# Altium schematic sheet CC-S12-V00-PowerSwitch.SchDoc: Power Switch (5V or USB to VBUS)
size A3; DrawnBy: Jonn Dillon; DocumentNumber: 13; SheetNumber: 13; SheetTotal: 13; Project: Chassis Controller (Interim) 2020
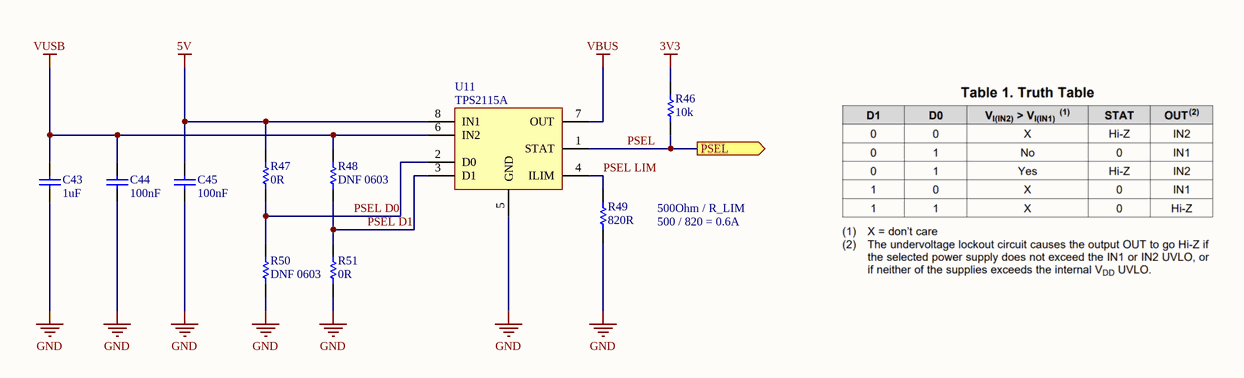
[diagram p0: CC-S12-V00-PowerSwitch.SchDoc]

## Parts
C43  1uF  [Cap_Ceramic_0603]
C44  100nF  [Cap_Ceramic_0603]
C45  100nF  [Cap_Ceramic_0603]
R46  10k  [Res_ThinFilm_0603]
R47  0R  [Res_ThinFilm_0603]
R48  DNF 0603  [Res_ThinFilm_0603]
R49  820R  [Res_ThinFilm_0603]
R50  DNF 0603  [Res_ThinFilm_0603]
R51  0R  [Res_ThinFilm_0603]
U11  TPS2115A  [TPS2115A]

## Ports
PSEL (out)

## Nets
3V3: R46.2
5V: C45.2 R47.2 U11.8(IN1)
GND: C43.1 C44.1 C45.1 R49.1 R50.1 R51.1 U11.5(GND)
VBUS: U11.7(OUT)
VUSB: C43.2 C44.2 R48.2 U11.6(IN2)
PSEL: R46.1 U11.1(STAT) ; port PSEL
PSEL D0: R47.1 R50.2 U11.2(D0)
PSEL D1: R48.1 R51.2 U11.3(D1)
PSEL LIM: R49.2 U11.4(ILIM)

## Notes on the sheet
- 500Ohm / R_LIM
- 500 / 820 = 0.6A
- Revision History:
- Sheet Title:
- Rev
- Date
- Description
- Project:
- Size:
- Drawn By:
- A3
- Number:
- Revision:
- Sheet
- Version:
- of
- QUT Motorsport
- O-120, Gardens Point
- 2 George Street
- Brisbane, QLD 4000
- Australia
- Print Date:
- Print Time:
- File Name:

## Library data of the parts
C43 = 1uF 25V 5% X7R 0603: Capacitor, Ceramic, SMD, 1uF, 25V, 5%, X7R, 0603
C44 C45 = 100nF 50V 5% X7R 0603: Capacitor, Ceramic, SMD, 100nF, 50V, 5%, X7R, 0603
R46 = 10k 5% 0603: Resistor, SMD, 10k, 0.1W, 5%, 0603
R47 R51 = 0R 5% 0603: Resistor, SMD, 0R, 0.1W, 5%, 0603
R48 R50 = DNF 0603: Resistor, SMD, DNF, 0.1W, 0603
R49 = 820R 5% 0603: Resistor, SMD, 820R, 0.1W, 5%, 0603
U11 = TPS2115A: OR Controller Source Selector Switch N-Channel 2:1 8-TSSOP; ComponentLink1Description: Digikey; ComponentLink1URL: https://www.digikey.com.au/product-detail/en/texas-instruments/TPS2115AIPWRQ1/296-24155-1-ND/2000840